# Altium schematic sheet ART-Pi_Memory.SchDoc: MOMERY_CFG
size A3; DocumentNumber: 8; Revision: V1.5; SheetNumber: 8; SheetTotal: 11; PageSetup: Record=PageOptions|CenterHorizontal=True|CenterVertical=True|PrintScale=1.01|XCorrection=1.00|YCorrection=1.00|PrintKind=0|BorderSize=5000000|LeftOffset=0|BottomOffset=0|Orientation=2|PaperLength=1000|PaperWidth=1000|Scale=100|PaperSource=7|PrintQuality=600|MediaType=1|DitherType=10|PrintScaleMode=1|PaperKind=A3(297x420mm)|PaperIndex=8
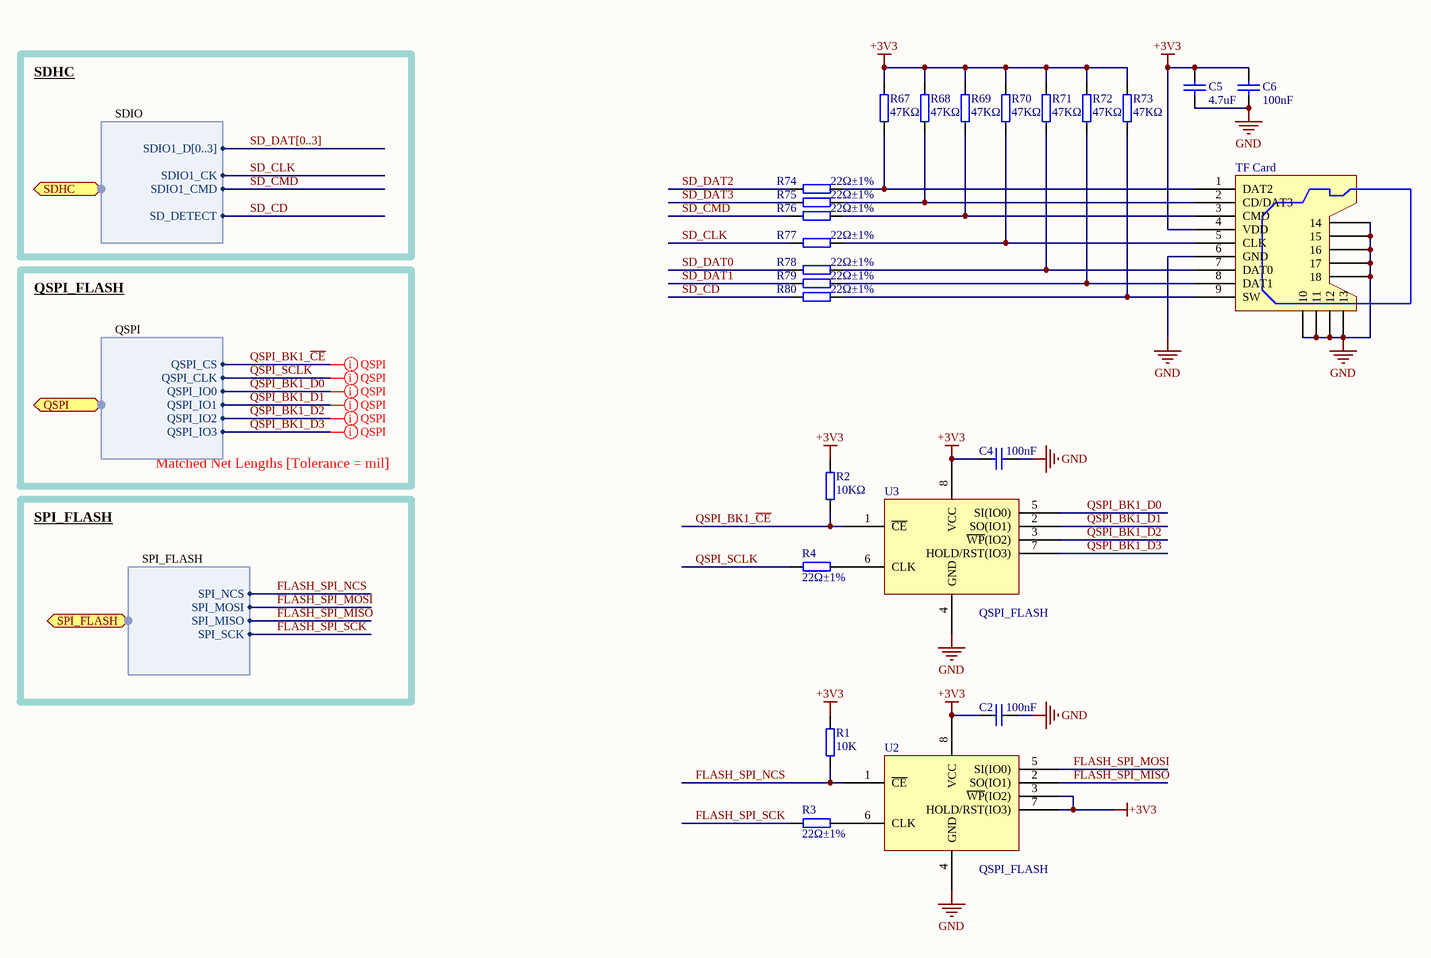
[diagram p0: ART-Pi_Memory.SchDoc]

## Parts
C2  100nF  [0402_C]
C4  100nF  [0402_C]
C5  4.7uF  [0402_C]
C6  100nF  [0402_C]
R1  10K  [0402_R]
R2  10KΩ  [0402_R]
R3  22Ω±1%  [0402_R]
R4  22Ω±1%  [0402_R]
R67  47KΩ  [0402_R]
R68  47KΩ  [0402_R]
R69  47KΩ  [0402_R]
R70  47KΩ  [0402_R]
R71  47KΩ  [0402_R]
R72  47KΩ  [0402_R]
R73  47KΩ  [0402_R]
R74  22Ω±1%  [0402_R]
R75  22Ω±1%  [0402_R]
R76  22Ω±1%  [0402_R]
R77  22Ω±1%  [0402_R]
R78  22Ω±1%  [0402_R]
R79  22Ω±1%  [0402_R]
R80  22Ω±1%  [0402_R]
TF_Card  microSD  [TF-SMD_TF-110]  (value not drawn)
U2  QSPI_FLASH  [SOIC_8]
U3  QSPI_FLASH  [SOIC_8]

## Ports
QSPI (harness Harness), SDHC (harness Harness), SPI_FLASH (harness Harness)

## Harnesses
Harness: SPI_NCS, SPI_MOSI, SPI_MISO, SPI_SCK
Harness: QSPI_CS, QSPI_CLK, QSPI_IO0, QSPI_IO1, QSPI_IO2, QSPI_IO3
Harness: SD_DETECT, SDIO1_D[0..3], SDIO1_CMD, SDIO1_CK

## Nets
+3V3: C2.2 C4.2 C5.2 C6.2 R1.1 R2.1 R67.1 R68.1 R69.1 R70.1 R71.1 R72.1 R73.1 TF_Card.4(VDD) U2.3(~{WP}(IO2)) U2.7(HOLD/RST(IO3)) U2.8(VCC) U3.8(VCC)
GND: C2.1 C4.1 C5.1 C6.1 TF_Card.6(GND) TF_Card.10 TF_Card.11 TF_Card.12 TF_Card.13 TF_Card.14 TF_Card.15 TF_Card.16 TF_Card.17 TF_Card.18 U2.4(GND) U3.4(GND)
FLASH_SPI_MISO: U2.2(SO(IO1)) ; port SPI_FLASH.SPI_MISO
FLASH_SPI_MOSI: U2.5(SI(IO0)) ; port SPI_FLASH.SPI_MOSI
FLASH_SPI_NCS: R1.2 U2.1(~{CE}) ; port SPI_FLASH.SPI_NCS
FLASH_SPI_SCK: R3.2 ; port SPI_FLASH.SPI_SCK
QSPI_BK1_~{CE}: R2.2 U3.1(~{CE}) ; port QSPI.QSPI_CS
QSPI_BK1_D0: U3.5(SI(IO0)) ; port QSPI.QSPI_IO0
QSPI_BK1_D1: U3.2(SO(IO1)) ; port QSPI.QSPI_IO1
QSPI_BK1_D2: U3.3(~{WP}(IO2)) ; port QSPI.QSPI_IO2
QSPI_BK1_D3: U3.7(HOLD/RST(IO3)) ; port QSPI.QSPI_IO3
QSPI_SCLK: R4.2 ; port QSPI.QSPI_CLK
SD_CD: R80.2 ; port SDHC.SD_DETECT
SD_CLK: R77.2 ; port SDHC.SDIO1_CK
SD_CMD: R76.2 ; port SDHC.SDIO1_CMD
SD_DAT0: R78.2
SD_DAT1: R79.2
SD_DAT2: R74.2
SD_DAT3: R75.2
NetR3_1: R3.1 U2.6(CLK)
NetR4_1: R4.1 U3.6(CLK)
NetR67_2: R67.2 R74.1 TF_Card.1(DAT2)
NetR68_2: R68.2 R75.1 TF_Card.2(CD/DAT3)
NetR69_2: R69.2 R76.1 TF_Card.3(CMD)
NetR70_2: R70.2 R77.1 TF_Card.5(CLK)
NetR71_2: R71.2 R78.1 TF_Card.7(DAT0)
NetR72_2: R72.2 R79.1 TF_Card.8(DAT1)
NetR73_2: R73.2 R80.1 TF_Card.9(SW)

## Buses and harness runs
bus SD_DAT[0..3]

## Layout directives
rule Undefined: QSPI_BK1_D0, QSPI_BK1_D1, QSPI_BK1_D2, QSPI_BK1_D3, QSPI_BK1_~{CE}, QSPI_SCLK

## Notes on the sheet
- SDHC
- SDIO
- QSPI_FLASH
- QSPI
- Matched Net Lengths [Tolerance = mil]
- SPI_FLASH
- Title
- Size:
- Date:
- A3
- Number:
- Time:
- Revision:
- Sheet
- of
- File:

## Library data of the parts
C2 C4-C6 = Cap: Capacitor; Published: 8-Jun-2000; LatestRevisionDate: 17-Jul-2002; LatestRevisionNote: Re-released for DXP Platform.; PackageReference: RAD-0.3; Publisher: Altium Limited; PackageDescription: Radial Cap, Thru-Hole; 2 Leads; 0.3 in Pin Spacing
R1-R4 R67-R80 = Res: Resister
U2 U3 = W25Q128